# Altium schematic sheet POWER.SchDoc
size A4; SheetNumber: 2; SheetTotal: 4
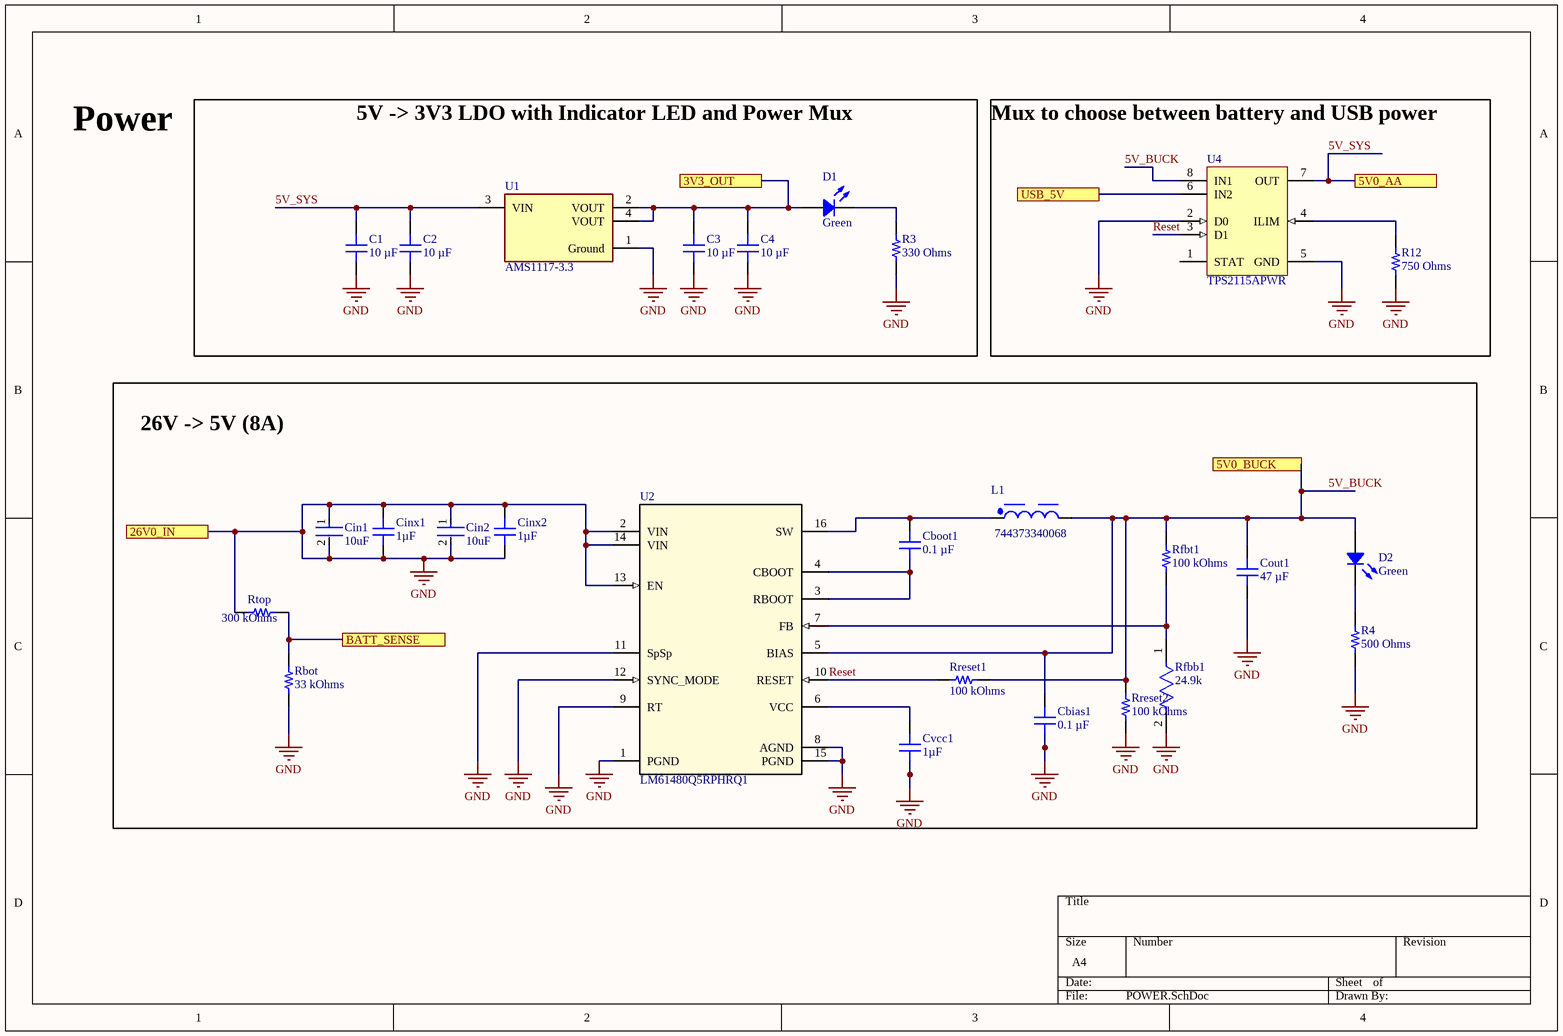
[diagram p0: POWER.SchDoc]

## Parts
C1  10 µF  [CAP 0603_1608]
C2  10 µF  [CAP 0603_1608]
C3  10 µF  [CAP 0603_1608]
C4  10 µF  [CAP 0603_1608]
Cbias1  0.1 µF  [CAP 0603_1608]
Cboot1  0.1 µF  [CAP 0603_1608]
Cin1  10uF  [FP-GRT31C-0_2-IPC_A]
Cin2  10uF  [FP-GRT31C-0_2-IPC_A]
Cinx1  1µF  [CAP 0603_1608]
Cinx2  1µF  [CAP 0603_1608]
Cout1  47 µF  [CAP 0603_1608]
Cvcc1  1µF  [CAP 0603_1608]
D1  Green  [LED 0603_1608 GREEN]
D2  Green  [LED 0603_1608 GREEN]
L1  744373340068  [WE-LHMI_5020]
R3  330 Ohms  [RES 0603_1608]
R4  500 Ohms  [RES 1206_3216]
R12  750 Ohms  [RES 0603_1608]
Rbot  33 kOhms  [YAGEO RES 0603_1608]
Rfbb1  24.9k  [FP-TFCR0603-IPC_A]
Rfbt1  100 kOhms  [RES 0603_1608]
Rreset1  100 kOhms  [RES 0603_1608]
Rreset2  100 kOhms  [RES 0603_1608]
Rtop  300 kOhms  [YAGEO RES 0603_1608]
U1  AMS1117-3.3  [FP-AMS1117-IPC_C]
U2  LM61480Q5RPHRQ1  [RPH0016A]
U4  TPS2115APWR  [PW0008A_N]

## Blocks framed on the sheet
5V -> 3V3 LDO with Indicator LED and Power Mux: C1-C4 D1 R3 U1
Mux to choose between battery and USB power: R12 U4
26V -> 5V (8A): Cbias1 Cboot1 Cin1 Cin2 Cinx1 Cinx2 Cout1 Cvcc1 D2 L1 R4 Rbot Rfbb1 Rfbt1 Rreset1 Rreset2 Rtop U2

## Ports
3V3_OUT, 5V0_AA, 5V0_BUCK, 26V0_IN, BATT_SENSE, USB_5V

## Nets
GND: C1.1 C2.1 C3.1 C4.1 Cbias1.2 Cin1.1 Cin1.2 Cin2.1 Cin2.2 Cinx1.1 Cinx1.2 Cinx2.1 Cinx2.2 Cout1.2 Cvcc1.2 R3.1 R4.2 R12.2 Rbot.2 Rfbb1.2 Rreset2.2 Rtop.1 U1.1(Ground) U2.1(PGND) U2.2(VIN) U2.8(AGND) U2.9(RT) U2.11(SpSp) U2.12(SYNC_MODE) U2.13(EN) U2.14(VIN) U2.15(PGND) U4.2(D0) U4.5(GND) ; port 26V0_IN
3V3_OUT: C3.2 C4.2 D1.1 U1.2(VOUT) U1.4(VOUT) ; port 3V3_OUT
5V_BUCK: Cbias1.1 Cout1.1 D2.1 L1.2 Rfbt1.1 Rreset1.2 Rreset2.1 U2.5(BIAS) U4.8(IN1) ; port 5V0_BUCK
5V_SYS: C1.2 C2.2 U1.3(VIN) U4.7(OUT) ; port 5V0_AA
BATT_SENSE: Rbot.1 Rtop.2 ; port BATT_SENSE
Reset: Rreset1.1 U2.10(RESET) U4.3(D1)
USB_5V: U4.6(IN2) ; port USB_5V
NetCboot1_1: Cboot1.1 L1.1 U2.16(SW)
NetCboot1_2: Cboot1.2 U2.3(RBOOT) U2.4(CBOOT)
NetCvcc1_1: Cvcc1.1 U2.6(VCC)
NetD1_2: D1.2 R3.2
NetD2_2: D2.2 R4.1
NetR12_1: R12.1 U4.4(ILIM)
NetRfbb1_1: Rfbb1.1 Rfbt1.2 U2.7(FB)

Not connected (* = marked no-connect by the designer): U4 1(STAT)

## Notes on the sheet
- Power

## Library data of the parts
C1-C4 = CM105X5R106K16AT: 0603 X5R 10UF10% 16V; manufacturer: KYOCERA AVX; Tolerance: ±10%; Part Number: CM105X5R106K16AT; Value: 10 µF; Applications: General Purpose; Capacitance: 10 µF; componentlink1description: Datasheet; componentlink1url: https://ele.kyocera.com/assets/products/capacitor/CM_Series_e.pdf; componentlink2description: DigiKey Link; componentlink2url: https://www.digikey.com/en/products/detail/kyocera-avx/CM105X5R106K16AT/17866311; Device Package: 0603 (1608 Metric); lastupdated: 2/9/2024 8:08:53 PM; Lifecycle Status: Active; Minimum Order: 1; Mounting Type: Surface Mount, MLCC; Operating Temperature: -55°C ~ 85°C; Package / Case: 0603 (1608 Metric); packaging: TapeAndReel; partid: 55416; Part Status: Active; price: 0.03; series: CM; Size / Dimension: 0.063" L x 0.031" W (1.60mm x 0.80mm); Supplier 1: DigiKey; Supplier Part Number 1: 478-CM105X5R106K16ATCT-ND; Temperature Coefficient: X5R; Thickness (Max): 0.039" (1.00mm); Voltage - Rated: 16V
Cbias1 Cboot1 = C0603C104K5RAC7411: CAP CER 0.1UF 50V X7R 0603; manufacturer: KEMET; Tolerance: ±10%; Part Number: C0603C104K5RAC7411; Capacitance: 0.1 µF; Applications: Bypass, Decoupling; componentlink1description: Datasheet; componentlink1url: https://api.kemet.com/component-edge/download/datasheet/C0603C104K5RAC7411.pdf; componentlink2description: DigiKey Link; componentlink2url: https://www.digikey.com/en/products/detail/kemet/C0603C104K5RAC7411/3317013; Device Package: 0603 (1608 Metric); lastupdated: 2024-02-09 8:10:30 PM; Lifecycle Status: Active; Minimum Order: 1; Mounting Type: Surface Mount, MLCC; Operating Temperature: -55°C ~ 125°C; Package / Case: 0603 (1608 Metric); packaging: TapeAndReel; partid: 2233; Part Status: Active; price: 0.01; series: SMD Comm X7R; Size / Dimension: 0.063" L x 0.031" W (1.60mm x 0.80mm); Supplier 1: DigiKey; Supplier Part Number 1: 399-C0603C104K5RAC7411CT-ND; Temperature Coefficient: X7R; Thickness (Max): 0.035" (0.90mm); value: 0.1 µF; Voltage - Rated: 50V
Cin1 Cin2 = CMP-06035-048951-1: CAP CER 10UF 50V X5R 1206; Tolerance: 20%; Length: 0.126inch; Mount: Surface Mount; Packaging: Tape and Reel; Capacitance: 10uF; Case/Package: 1206; Case Code (Imperial): 1206; Max Operating Temperature: 85°C; Voltage Rating: 50V; Ratings: AEC-Q200; Min Operating Temperature: -55°C; Thickness: 0.071inch; Width: 0.063inch; Case Code (Metric): 3216
Cinx1 Cinx2 Cvcc1 = 06035D105MAT2A: CAP CER 1UF 50V X5R 0603; manufacturer: AVX Corporation; Tolerance: ±20%; Part Number: 06035D105MAT2A; Capacitance: 1µF; Applications: General Purpose; componentlink1description: Datasheet; componentlink1url: http://datasheets.avx.com/cx5r.pdf; componentlink2description: DigiKey Link; componentlink2url: http://digikey.com/product-detail/en/avx-corporation/06035D105MAT2A/478-11443-1-ND/8019298; Device Package: 0603 (1608 Metric); lastupdated: 2020-09-02 1:03:34 AM; Lifecycle Status: Active; Minimum Order: 1; Mounting Type: Surface Mount, MLCC; Operating Temperature: -55°C ~ 85°C; Package / Case: 0603 (1608 Metric); packaging: TapeAndReel; partid: 3200; Part Status: Active; price: 0.05; series: -; Size / Dimension: 0.063" L x 0.032" W (1.60mm x 0.81mm); Supplier 1: DigiKey; Supplier Part Number 1: 478-11443-1-ND; Temperature Coefficient: X5R; Thickness (Max): 0.035" (0.90mm); value: 1µF; Voltage - Rated: 50V
Cout1 = CL10A476MQ8QRNC: CAP CER 47UF 6.3V X5R 0603; manufacturer: Samsung Electro-Mechanics; Tolerance: ±20%; Part Number: CL10A476MQ8QRNC; Capacitance: 47 µF; Applications: General Purpose; componentlink1description: Datasheet; componentlink1url: https://media.digikey.com/pdf/Data%20Sheets/Samsung%20PDFs/CL10A476MQ8QRNC_Spec.pdf; componentlink2description: DigiKey Link; componentlink2url: https://www.digikey.com/en/products/detail/samsung-electro-mechanics/CL10A476MQ8QRNC/10478988; Device Package: 0603 (1608 Metric); lastupdated: 2024-02-09 8:09:49 PM; Lifecycle Status: Active; Minimum Order: 1; Mounting Type: Surface Mount, MLCC; Operating Temperature: -55°C ~ 85°C; Package / Case: 0603 (1608 Metric); packaging: TapeAndReel; partid: 45940; Part Status: Active; price: 0.29; series: CL; Size / Dimension: 0.063" L x 0.031" W (1.60mm x 0.80mm); Supplier 1: DigiKey; Supplier Part Number 1: 1276-CL10A476MQ8QRNCCT-ND; Temperature Coefficient: X5R; Thickness (Max): 0.039" (1.00mm); value: 47 µF; Voltage - Rated: 6.3V
D1 D2 = 150060GS75003: LED GREEN CLEAR 0603 SMD; Manufacturer: Würth Elektronik; Current - Test: 20mA; Lens Color: Colorless; Lens Size: 1.10mm x 0.80mm; Lens Style: Rectangle with Flat Top; Millicandela Rating: 1600mcd; Viewing Angle: 140°; Voltage - Forward (Vf) (Typ): 3.2V; Wavelength - Dominant: 525nm; Wavelength - Peak: 515nm; Part Number: 150060GS75003; Color: Green; ComponentLink1Description: Datasheet; ComponentLink1URL: https://www.we-online.com/catalog/datasheet/150060GS75003.pdf; ComponentLink2Description: DigiKey Link; ComponentLink2URL: https://www.digikey.com/en/products/detail/würth-elektronik/150060GS75003/16022170; Device Package: 0603 (1608 Metric); Height (Max): 0.80mm; LastUpdated: 6/3/2024 7:58:49 PM; Lens Transparency: Clear; Lifecycle Status: Active; Minimum Order: 1; Mounting Type: Surface Mount; Package / Case: 0603 (1608 Metric); Packaging: TapeAndReel; PartId: 1111; Part Status: Active; Price: 0.18; Series: WL-SMCW; Size / Dimension: 1.60mm L x 0.80mm W; Supplier 1: DigiKey; Supplier Part Number 1: 732-150060GS75003CT-ND; Supplier Device Package: 0603; Value: Green
L1 = CMP-03913-52738382-5: We-lhmi Series, Shielded Wire-wound SMD Inductor 680 Nh +/-20% Wire-wound 6.8A I; Tolerance: 20%; Test Frequency: 100kHz; Inductance: 680nH; Self Resonant Frequency: 90MHz; Saturation Current: 9.8A; DC Resistance (DCR): 11mΩ; Core Material: Ferrite; Width: 5.2mm; Shielding: Shielded; Current Rating: 6.8A; REACH SVHC: Unknown; RMS Current (Irms): 6.8A; Max Operating Temperature: 125°C; Termination: SMD/SMT; Ambient Temperature Range Low: -40°C; Composition: Wirewound; Height: 1.8mm; Mount: Surface Mount; Max DC Current: 6.8A; Number of Pins: 2; Height - Seated (Max): 1.9812mm; Length: 5.7mm; Case/Package: SMD/SMT; Ambient Temperature Range High: 85°C; Inductance Tolerance: 20%; Min Operating Temperature: -40°C; RoHS: Compliant
R3 = ERA-3VEB3300V: RES 330 OHM 0.1% 1/8W 0603; Manufacturer: Panasonic Electronic Components; Power (Watts): 0.125W, 1/8W; Temperature Coefficient: ±25ppm/°C; Part Number: ERA-3VEB3300V; Value: 330 Ohms; ComponentLink1Description: Datasheet; ComponentLink1URL: https://b2b-api.panasonic.eu/file_stream/pids/fileversion/9152; ComponentLink2Description: DigiKey Link; ComponentLink2URL: https://www.digikey.com/en/products/detail/panasonic-electronic-components/ERA-3VEB3300V/12085193; Composition: Thin Film; Device Package: 0603 (1608 Metric); Features: Anti-Sulfur, Automotive AEC-Q200; Height - Seated (Max): 0.022" (0.55mm); LastUpdated: 2/9/2024 8:41:22 PM; Lifecycle Status: Active; Minimum Order: 1; Number of Terminations: 2; Operating Temperature: -55°C ~ 155°C; Package / Case: 0603 (1608 Metric); Packaging: TapeAndReel; PartId: 62303; Part Status: Active; Price: 0.10; Ratings: AEC-Q200; Resistance: 330 Ohms; Series: ERA-3V; Size / Dimension: 0.063" L x 0.031" W (1.60mm x 0.80mm); Supplier 1: DigiKey; Supplier Part Number 1: 10-ERA-3VEB3300VCT-ND; Supplier Device Package: 0603; Tolerance: ±0.1%
R4 = PLT1206Z5000AST5: RES SMD 500 OHM 0.05% 0.4W 1206; Manufacturer: Vishay Thin Film; Power (Watts): 0.4W, 2/5W; Temperature Coefficient: ±5ppm/°C; Part Number: PLT1206Z5000AST5; ComponentLink1Description: Datasheet; ComponentLink1URL: http://www.vishay.com/docs/60030/plt.pdf; ComponentLink2Description: DigiKey Link; ComponentLink2URL: http://digikey.com/product-detail/en/vishay-thin-film/PLT1206Z5000AST5/PLT1206-500ACT-ND/2120427; Composition: Thin Film; Device Package: 1206 (3216 Metric); Features: Anti-Corrosive, Flame Proof, Moisture Resistant, Safety; Height - Seated (Max): 0.033" (0.84mm); LastUpdated: 2024-02-09 8:54:28 PM; Lifecycle Status: Active; Minimum Order: 1; Number of Terminations: 2; Operating Temperature: -55°C ~ 125°C; Package / Case: 1206 (3216 Metric); Packaging: TapeAndReel; PartId: 30946; Part Status: Active; Price: 2.64; Resistance: 500 Ohms; Series: PLT; Size / Dimension: 0.126" L x 0.063" W (3.20mm x 1.60mm); Supplier 1: DigiKey; Supplier Part Number 1: PLT1206-500ACT-ND; Supplier Device Package: 1206; Tolerance: ±0.05%; Value: 500 Ohms
R12 = CPF0603F750RC1: RES SMD 750 OHM 1% 1/16W 0603; Manufacturer: TE Connectivity Passive Product; Power (Watts): 0.063W, 1/16W; Temperature Coefficient: ±50ppm/°C; Part Number: CPF0603F750RC1; Value: 750 Ohms; ComponentLink1Description: Datasheet; ComponentLink1URL: https://www.te.com/commerce/DocumentDelivery/DDEController?Action=srchrtrv&DocNm=1773200&DocType=DS&DocLang=English; ComponentLink2Description: DigiKey Link; ComponentLink2URL: https://www.digikey.com/en/products/detail/te-connectivity-passive-product/CPF0603F750RC1/2384377; Composition: Thin Film; Device Package: 0603 (1608 Metric); Height - Seated (Max): 0.022" (0.55mm); LastUpdated: 2024-02-09 8:43:28 PM; Lifecycle Status: Active; Minimum Order: 1; Number of Terminations: 2; Operating Temperature: -55°C ~ 155°C; Package / Case: 0603 (1608 Metric); Packaging: TapeAndReel; PartId: 7040; Part Status: Active; Price: 0.02; Resistance: 750 Ohms; Series: CPF, Neohm; Size / Dimension: 0.061" L x 0.031" W (1.55mm x 0.80mm); Supplier 1: DigiKey; Supplier Part Number 1: A102316CT-ND; Supplier Device Package: 0603; Tolerance: ±1%
Rbot = RT0603FRE0733KL: RES SMD 33K OHM 1% 1/10W 0603; Manufacturer: Yageo; Power (Watts): 0.1W, 1/10W; Temperature Coefficient: ±50ppm/°C; Part Number: RT0603FRE0733KL; Value: 33 kOhms; ComponentLink1Description: Datasheet; ComponentLink1URL: https://www.yageo.com/upload/media/product/productsearch/datasheet/rchip/PYu-RT_1-to-0.01_RoHS_L_11.pdf; ComponentLink2Description: DigiKey Link; ComponentLink2URL: https://www.digikey.com/en/products/detail/yageo/RT0603FRE0733KL/1075313; Composition: Thin Film; Device Package: 0603 (1608 Metric); Height - Seated (Max): 0.022" (0.55mm); LastUpdated: 2024-07-25 9:19:32 AM; Lifecycle Status: Active; Minimum Order: 1; Number of Terminations: 2; Operating Temperature: -55°C ~ 155°C; Package / Case: 0603 (1608 Metric); Packaging: TapeAndReel; PartId: 5680; Part Status: Active; Price: 0.01; Resistance: 33 kOhms; Series: RT; Size / Dimension: 0.063" L x 0.031" W (1.60mm x 0.80mm); Supplier 1: DigiKey; Supplier Part Number 1: YAG5959CT-ND; Supplier Device Package: 0603; Tolerance: ±1%
Rfbb1 = CMP-250906-231724-1: RES Thin Film,  24.9kΩ, 1%, 0.1W, 50ppm/°C, 0603
Rfbt1 Rreset1 Rreset2 = RNCS0603BKE100K: RES 100K OHM 0.1% 1/16W 0603; Manufacturer: Stackpole Electronics Inc; Power (Watts): 0.063W, 1/16W; Temperature Coefficient: ±25ppm/°C; Part Number: RNCS0603BKE100K; Value: 100 kOhms; ComponentLink1Description: Datasheet; ComponentLink1URL: https://www.seielect.com/catalog/sei-rncs_rnch.pdf; ComponentLink2Description: DigiKey Link; ComponentLink2URL: https://www.digikey.com/en/products/detail/stackpole-electronics-inc/RNCS0603BKE100K/1708835; Composition: Thin Film; Device Package: 0603 (1608 Metric); Features: Anti-Corrosive, Automotive AEC-Q200, Moisture Resistant; Height - Seated (Max): 0.022" (0.55mm); LastUpdated: 2024-02-09 8:43:37 PM; Lifecycle Status: Active; Minimum Order: 1; Number of Terminations: 2; Operating Temperature: -55°C ~ 155°C; Package / Case: 0603 (1608 Metric); Packaging: TapeAndReel; PartId: 4849; Part Status: Active; Price: 0.06; Ratings: AEC-Q200; Resistance: 100 kOhms; Series: RNCS; Size / Dimension: 0.061" L x 0.031" W (1.55mm x 0.80mm); Supplier 1: DigiKey; Supplier Part Number 1: RNCS0603BKE100KCT-ND; Supplier Device Package: 0603; Tolerance: ±0.1%
Rtop = RC0603FR-07300KL: RES 300K OHM 1% 1/10W 0603; Manufacturer: Yageo; Power (Watts): 0.1W, 1/10W; Temperature Coefficient: ±100ppm/°C; Part Number: RC0603FR-07300KL; Value: 300 kOhms; ComponentLink1Description: Datasheet; ComponentLink1URL: https://www.yageo.com/upload/media/product/productsearch/datasheet/rchip/PYu-RC_Group_51_RoHS_L_10.pdf; ComponentLink2Description: DigiKey Link; ComponentLink2URL: https://www.digikey.com/en/products/detail/yageo/RC0603FR-07300KL/727145; Composition: Thick Film; Device Package: 0603 (1608 Metric); Features: Moisture Resistant; Height - Seated (Max): 0.022" (0.55mm); LastUpdated: 2024-07-25 9:19:32 AM; Lifecycle Status: Active; Minimum Order: 1; Number of Terminations: 2; Operating Temperature: -55°C ~ 155°C; Package / Case: 0603 (1608 Metric); Packaging: CutTape; PartId: 7517; Part Status: Active; Price: 0.01; Resistance: 300 kOhms; Series: RC_L; Size / Dimension: 0.063" L x 0.031" W (1.60mm x 0.80mm); Supplier 1: DigiKey; Supplier Part Number 1: 311-300KHRCT-ND; Supplier Device Package: 0603; Tolerance: ±1%
U1 = CMP-209535-000001-1: LDO Voltage Regulators 1A, 3.3V; Manufacturer: Advanced Monolithic Systems; Dropout Voltage: 1.1V; Output Type: Fixed; Nominal Supply Current: 5mA; Max Power Dissipation: 1.2W; Max Supply Voltage: 15V; Number Of Outputs: 1; Standoff Height: 0.64mm; Max Junction Temp: +125°C; Height: 1.8mm; Package: AMS1117; Device Class L2: Power Management ICs; ComponentLink2Description: Datasheet; ComponentLink2URL: http://www.advanced-monolithic.com/pdf/ds1117.pdf; Category: IC; RoHS: TRUE; Automotive: No; Device Class L1: Integrated Circuits (ICs); Output Current: 1A; Device Class L3: Voltage Regulators - Linear; Temperature: -40°C to +125°C; Output Voltage: 3.3V; Manufacturer Part Number: AMS1117-3.3; Temperature Range Low: -40°C; Octopart: https://octopart.com/ams1117-3.3-advanced+monolithic+systems-25899300; Lead Free: Yes; Ipc Land Pattern Name: SOT229P700X180-4; Temperature Range High: +125°C
U2 = LM61480Q5RPHRQ1: Automotive 8A buck converter optimized for power density and low EMI 16-VQFN-HR -40 to 150; Manufacturer_Name: Texas Instruments; TYPE: TYPE; RefDes: RefDes; Copyright: Copyright (C) 2025 Ultra Librarian. All rights reserved.; Manufacturer_Part_Number: LM61480Q5RPHRQ1; Supplier 1: DigiKey; Supplier Part Number 1: 296-LM61480Q5RPHRQ1CT-ND
U4 = CMP-0339-00018-2: Dual In / Single Out Autoswitching Power Mux, 2.8 to 5.5 V, -40 to 85 degC, 8-pin TSSOP (PW), Green (RoHS & no Sb/Br); Manufacturer: Texas Instruments; SubFamily: Power Multiplexer (MUX); IN2 rDS(on)(Typ)(Ohms): 0.084; Number of Inputs: 2; IN1, IN2 Input Voltage(Max)(V): 5.5; IN1, IN2 Input Voltage(Min)(V): 2.8; IN1 rDS(on)(Typ)(mOhm): 84; IN2 Output Current(Max)(A): 1.25; PackageDescription: 8-Pin Plastic Thin Small Outline Package 3 x 4.4 mm Body ,0.65 mm Pitch; PackageVersion: revG, Feb-2011; ComponentLink1Description: Datasheet; Mounting Technology: Surface Mount; PartNumber: TPS2115APWR; DatasheetVersion: SBVS044F; Eco-Plan: Green (RoHS & no Sb/Br); Code_JEDEC: MO-153; PackageReference: PW0008A; IN1 Output Current(Max)(A): 1.25; ComponentLink1URL: http://www.ti.com/general/docs/lit/getliterature.tsp?genericPartNumber=TPS2115A&fileType=pdf